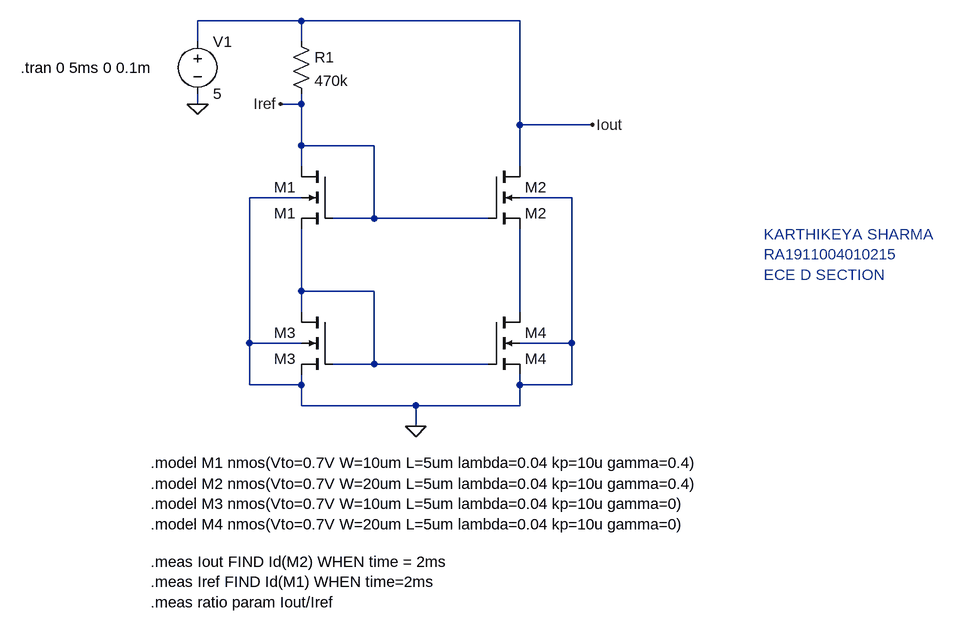
[diagram p0: schematic cascode_current_mirror.asc]
cascode_current_mirror.asc, the LTspice schematic file:
Version 4
SHEET 1 1264 680
WIRE 288 -896 128 -896
WIRE 624 -896 288 -896
WIRE 128 -864 128 -896
WIRE 288 -864 288 -896
WIRE 128 -768 128 -784
WIRE 288 -768 288 -784
WIRE 288 -768 256 -768
WIRE 624 -736 624 -896
WIRE 736 -736 624 -736
WIRE 288 -704 288 -768
WIRE 400 -704 288 -704
WIRE 288 -672 288 -704
WIRE 624 -672 624 -736
WIRE 288 -624 208 -624
WIRE 704 -624 624 -624
WIRE 400 -592 400 -704
WIRE 400 -592 336 -592
WIRE 576 -592 400 -592
WIRE 288 -480 288 -576
WIRE 400 -480 288 -480
WIRE 288 -448 288 -480
WIRE 624 -448 624 -576
WIRE 208 -400 208 -624
WIRE 288 -400 208 -400
WIRE 704 -400 704 -624
WIRE 704 -400 624 -400
WIRE 400 -368 400 -480
WIRE 400 -368 336 -368
WIRE 576 -368 400 -368
WIRE 208 -336 208 -400
WIRE 288 -336 288 -352
WIRE 288 -336 208 -336
WIRE 624 -336 624 -352
WIRE 704 -336 704 -400
WIRE 704 -336 624 -336
WIRE 288 -304 288 -336
WIRE 464 -304 288 -304
WIRE 624 -304 624 -336
WIRE 624 -304 464 -304
WIRE 464 -272 464 -304
FLAG 464 -272 0
FLAG 128 -768 0
FLAG 736 -736 Iout
FLAG 256 -768 Iref
SYMBOL nmos4 576 -672 R0
SYMATTR InstName M2
SYMATTR Value M2
SYMBOL nmos4 576 -448 R0
SYMATTR InstName M4
SYMATTR Value M4
SYMBOL nmos4 336 -672 M0
SYMATTR InstName M1
SYMATTR Value M1
SYMBOL nmos4 336 -448 M0
SYMATTR InstName M3
SYMATTR Value M3
SYMBOL voltage 128 -880 R0
WINDOW 123 0 0 Left 0
WINDOW 39 0 0 Left 0
SYMATTR InstName V1
SYMATTR Value 5
SYMBOL res 272 -880 R0
SYMATTR InstName R1
SYMATTR Value 470k
TEXT 56 -216 Left 2 !.model M1 nmos(Vto=0.7V W=10um L=5um lambda=0.04 kp=10u gamma=0.4)
TEXT 56 -184 Left 2 !.model M2 nmos(Vto=0.7V W=20um L=5um lambda=0.04 kp=10u gamma=0.4)\n.model M3 nmos(Vto=0.7V W=10um L=5um lambda=0.04 kp=10u gamma=0)\n.model M4 nmos(Vto=0.7V W=20um L=5um lambda=0.04 kp=10u gamma=0)
TEXT 56 -64 Left 2 !.meas Iout FIND Id(M2) WHEN time = 2ms\n.meas Iref FIND Id(M1) WHEN time=2ms\n.meas ratio param Iout/Iref
TEXT -144 -824 Left 2 !.tran 0 5ms 0 0.1m
TEXT 1000 -568 Left 2 ;KARTHIKEYA SHARMA\nRA1911004010215\nECE D SECTION

The netlist it stands for:
* cascode_current_mirror.asc
M2 Iout Iref N002 0 M2
M4 N002 N001 0 0 M4
M1 Iref Iref N001 0 M1
M3 N001 N001 0 0 M3
V1 Iout 0 5
R1 Iout Iref 470k
.model NMOS NMOS
.model PMOS PMOS
.lib standard.mos
.model M1 nmos(Vto=0.7V W=10um L=5um lambda=0.04 kp=10u gamma=0.4)
.model M2 nmos(Vto=0.7V W=20um L=5um lambda=0.04 kp=10u gamma=0.4)
.model M3 nmos(Vto=0.7V W=10um L=5um lambda=0.04 kp=10u gamma=0)
.model M4 nmos(Vto=0.7V W=20um L=5um lambda=0.04 kp=10u gamma=0)
.meas Iout FIND Id(M2) WHEN time = 2ms
.meas Iref FIND Id(M1) WHEN time=2ms
.meas ratio param Iout/Iref
.tran 0 5ms 0 0.1m
* KARTHIKEYA SHARMA
* RA1911004010215
* ECE D SECTION
.backanno
.end